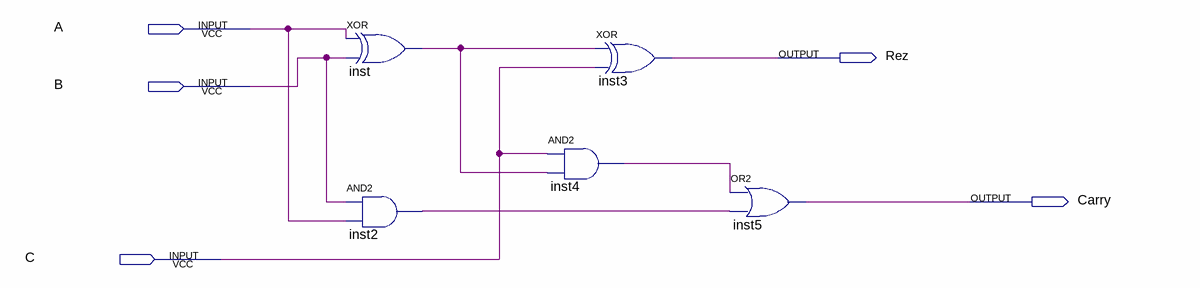
[diagram p0: schematic sheet]
// Quartus schematic ADD1.bdf as structural Verilog: 5 symbols, 5 pins
module ADD1 (
  input  A,
  input  B,
  input  C,
  output Rez,
  output Carry
);

  wire inst2_out, inst4_out, inst_out;

  xor inst (inst_out, A, B);
  and inst2 (inst2_out, B, A);
  and inst4 (inst4_out, C, inst_out);
  xor inst3 (Rez, inst_out, C);
  or inst5 (Carry, inst4_out, inst2_out);
endmodule
